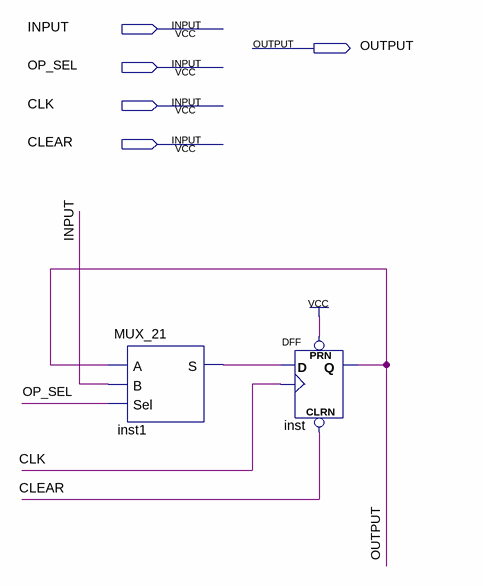
[diagram p0: schematic sheet]
// Quartus schematic ONE_BIT_REGISTER.bdf as structural Verilog: 2 symbols, 5 pins
module ONE_BIT_REGISTER (
  input  INPUT,
  input  OP_SEL,
  input  CLK,
  input  CLEAR,
  output OUTPUT
);

  wire inst1_s;

  MUX_21 inst1 (.A(OUTPUT), .B(INPUT), .Sel(OP_SEL), .S(inst1_s));
  DFF inst (.CLRN(CLEAR), .CLK(CLK), .D(inst1_s), .PRN(1'b1), .Q(OUTPUT));
endmodule
